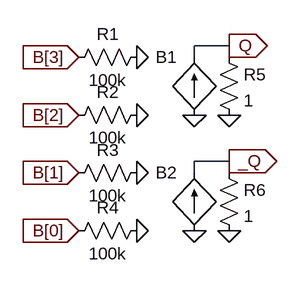
[diagram p0: schematic 4bit_and-fast.asc]
4bit_and-fast.asc, the LTspice schematic file:
Version 4
SHEET 1 880 680
WIRE 192 80 144 80
WIRE 144 96 144 80
WIRE 192 96 192 80
WIRE 192 240 144 240
WIRE 144 256 144 240
WIRE 192 256 192 240
FLAG 192 80 Q
IOPIN 192 80 Out
FLAG 192 240 _Q
IOPIN 192 240 Out
FLAG -16 96 B[3]
IOPIN -16 96 In
FLAG -16 176 B[2]
IOPIN -16 176 In
FLAG -16 256 B[1]
IOPIN -16 256 In
FLAG -16 336 B[0]
IOPIN -16 336 In
FLAG 64 96 0
FLAG 64 336 0
FLAG 64 256 0
FLAG 64 176 0
FLAG 144 176 0
FLAG 192 176 0
FLAG 144 336 0
FLAG 192 336 0
SYMBOL res 80 80 R90
WINDOW 0 0 56 VBottom 2
WINDOW 3 32 56 VTop 2
SYMATTR InstName R1
SYMATTR Value 100k
SYMBOL res 80 160 R90
WINDOW 0 0 56 VBottom 2
WINDOW 3 32 56 VTop 2
SYMATTR InstName R2
SYMATTR Value 100k
SYMBOL res 80 240 R90
WINDOW 0 0 56 VBottom 2
WINDOW 3 32 56 VTop 2
SYMATTR InstName R3
SYMATTR Value 100k
SYMBOL res 80 320 R90
WINDOW 0 0 56 VBottom 2
WINDOW 3 32 56 VTop 2
SYMATTR InstName R4
SYMATTR Value 100k
SYMBOL bi 144 176 R180
WINDOW 0 24 80 Left 2
WINDOW 3 24 0 Invisible 2
SYMATTR InstName B1
SYMATTR Value I=V(B[3])&V(B[2])&V(B[1])&V(B[0])
SYMBOL res 176 80 R0
SYMATTR InstName R5
SYMATTR Value 1
SYMBOL res 176 240 R0
SYMATTR InstName R6
SYMATTR Value 1
SYMBOL bi 144 336 R180
WINDOW 0 24 80 Left 2
WINDOW 3 24 0 Invisible 2
SYMATTR InstName B2
SYMATTR Value I=!I(B1)

The netlist it stands for:
* 4bit_and-fast.asc
R1 0 B[3] 100k
R2 0 B[2] 100k
R3 0 B[1] 100k
R4 0 B[0] 100k
B1 0 Q I=V(B[3])&V(B[2])&V(B[1])&V(B[0])
R5 Q 0 1
R6 _Q 0 1
B2 0 _Q I=!I(B1)
.backanno
.end